# EAGLE schematic hhv-dcdarknet-display (EAGLE 7.2.0)
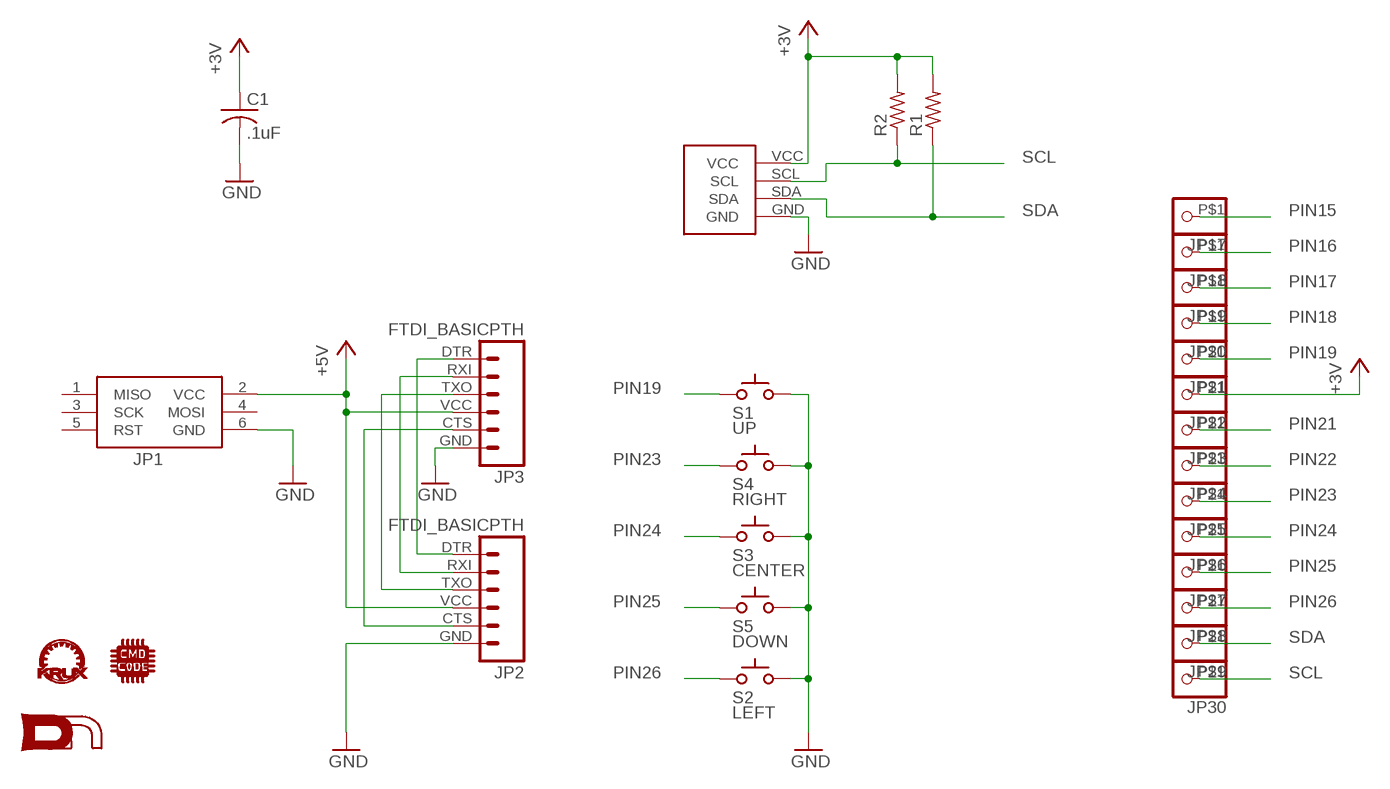
[diagram p0: schematic, sheet 1]

## Parts
C1  .1uF  C-US025-030X050  [C025-030X050]
JP1  JP1  AVRISP-6  [AVRISP]
JP2  FTDI_BASICPTH  [FTDI_BASIC]
JP3  FTDI_BASICPTH  [FTDI_BASIC]
JP17  PINHD-1X11X1_SQUARE  [1X1-SMALL_CUT]
JP18  PINHD-1X11X1_SQUARE  [1X1-SMALL_CUT]
JP19  PINHD-1X11X1_SQUARE  [1X1-SMALL_CUT]
JP20  PINHD-1X11X1_SQUARE  [1X1-SMALL_CUT]
JP21  PINHD-1X11X1_SQUARE  [1X1-SMALL_CUT]
JP22  PINHD-1X11X1_SQUARE  [1X1-SMALL_CUT]
JP23  PINHD-1X11X1_SQUARE  [1X1-SMALL_CUT]
JP24  PINHD-1X11X1_SQUARE  [1X1-SMALL_CUT]
JP25  PINHD-1X11X1_SQUARE  [1X1-SMALL_CUT]
JP26  PINHD-1X11X1_SQUARE  [1X1-SMALL_CUT]
JP27  PINHD-1X11X1_SQUARE  [1X1-SMALL_CUT]
JP28  PINHD-1X11X1_SQUARE  [1X1-SMALL_CUT]
JP29  PINHD-1X11X1_SQUARE  [1X1-SMALL_CUT]
JP30  PINHD-1X11X1_SQUARE  [1X1-SMALL_CUT]
R1  R-US_0204/7  [0204/7]
R2  R-US_0204/7  [0204/7]
S1  UP  SWITCH_TACTILETACTILE-2PIN  [TACTILE-2PIN]
S2  LEFT  SWITCH_TACTILETACTILE-2PIN  [TACTILE-2PIN]
S3  CENTER  SWITCH_TACTILETACTILE-2PIN  [TACTILE-2PIN]
S4  RIGHT  SWITCH_TACTILETACTILE-2PIN  [TACTILE-2PIN]
S5  DOWN  SWITCH_TACTILETACTILE-2PIN  [TACTILE-2PIN]
U$1  KRUX_LOGO  [KRUX_LOGO]
U$2  DN_LOGO  [DN_LOGO]
U$3  I2C_0.96_OLEDOLED  [I2C_0.96_OLED]
U$4  CMDC0DE_LOGO  [CMDC0DE]

## Nets
+3V3: C1.1 JP22.P$1 R1.2 R2.2 U$3.VCC ; supply symbol labelled +3V
+5V: JP1.2(VCC) JP2.VCC JP3.VCC
GND: C1.2 JP1.6(GND) JP2.GND JP3.GND S1.P$1(A) S2.P$1(A) S3.P$1(A) S4.P$1(A) S5.P$1(A) U$3.GND
N$1: JP2.DTR JP3.DTR
N$2: JP2.RXI JP3.RXI
N$3: JP2.TXO JP3.TXO
N$4: JP2.CTS JP3.CTS
PIN15: JP17.P$1
PIN16: JP18.P$1
PIN17: JP19.P$1
PIN18: JP20.P$1
PIN19: JP21.P$1 S1.P$2(C)
PIN21: JP23.P$1
PIN22: JP24.P$1
PIN23: JP25.P$1 S4.P$2(C)
PIN24: JP26.P$1 S3.P$2(C)
PIN25: JP27.P$1 S5.P$2(C)
PIN26: JP28.P$1 S2.P$2(C)
PIN27: JP29.P$1 R1.1 U$3.SDA
PIN28: JP30.P$1 R2.1 U$3.SCL
Unconnected: JP1.1(MISO) JP1.3(SCK) JP1.4(MOSI) JP1.5(RST)

## Notes on the sheet
- SCL
- SDA | PIN15
- PIN16
- PIN17
- PIN18
- PIN19
- PIN19
- PIN21
- PIN23 | PIN22
- PIN23
- PIN24 | PIN24
- PIN25
- PIN25 | PIN26
- SDA
- PIN26 | SCL

## Library data of the parts
C1 = adafruit:C-US: CAPACITOR, American symbol
JP1 = SYNShop:AVRISP: AVR ISP HEADER Standard 6 pin header for AVR programming
JP2 JP3 = SparkFun:FTDI_BASIC: FTDI Basic: 3.3V and 5V
JP17-JP30 = adafruit:PINHD-1X1: Pin header 1x1 for 0.1" spacing With round pins
R1 R2 = SYNShop:R-US_: RESISTOR, American symbol
S1-S5 = SYNShop:SWITCH_TACTILE
U$1 = SYNShop:KRUX_LOGO
U$2 = SYNShop:DN_LOGO
U$3 = SYNShop:I2C_0.96_OLED
U$4 = SYNShop:CMDC0DE_LOGO

## Net classes
0 default: clearance 0.205 mm